# EAGLE design trx (EAGLE 7.7.0)
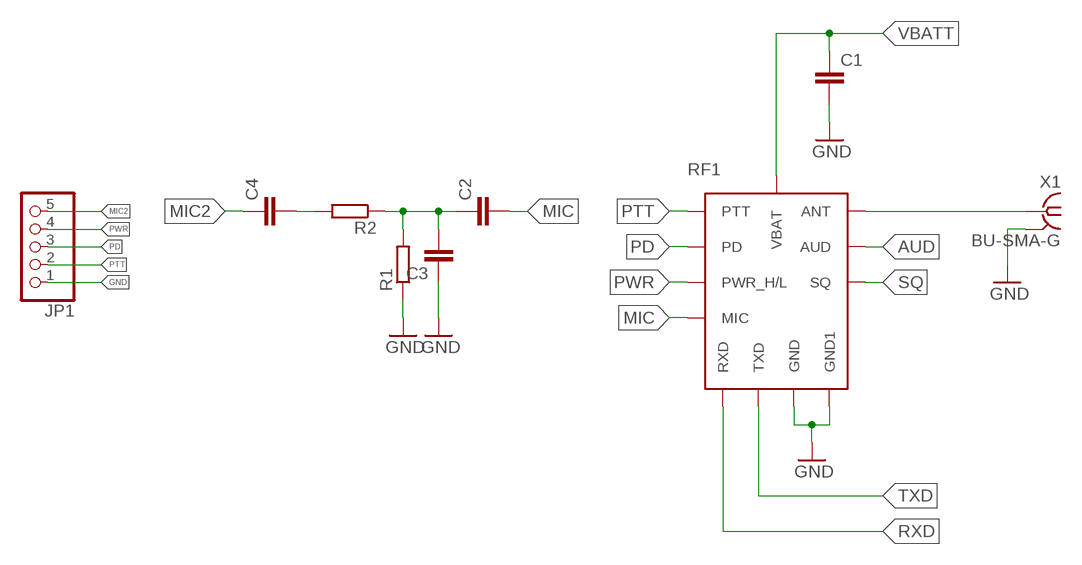
[diagram p0: schematic, sheet 1]

## Parts
C1  C-EUC1206  [C1206]
C2  C-EUC1206  [C1206]
C3  C-EUC1206  [C1206]
C4  C-EUC1206  [C1206]
JP1  PINHD-1X5  [1X05]
R1  R-EU_M1206  [M1206]
R2  R-EU_M1206  [M1206]
RF1  DRA818U  [DRA8XXZ]
X1  BU-SMA-G  [BU-SMA-G]

## Nets
ANT: RF1.P$12(ANT) X1.1
AUD: RF1.P$3(AUD)
GND: C1.2 C3.1 JP1.1 R1.1 RF1.P$9(GND) RF1.P$10(GND1) X1.2 X1.3 X1.4 X1.5
MIC: C2.2 RF1.P$18(MIC)
MIC2: C4.1 JP1.5
N$1: C2.1 C3.2 R1.2 R2.1
N$2: C4.2 R2.2
PD: JP1.3 RF1.P$6(PD)
PTT: JP1.2 RF1.P$5(PTT)
PWR: JP1.4 RF1.P$7(PWR_H/L)
RXD: RF1.P$16(RXD)
SQ: RF1.P$1(SQ)
TXD: RF1.P$17(TXD)
VBATT: C1.1 RF1.P$8(VBAT)

## Library data of the parts
C1-C4 = rcl:C-EU: CAPACITOR, European symbol
JP1 = pinhead:PINHD-1X5: PIN HEADER
R1 R2 = rcl:R-EU_: RESISTOR, European symbol
RF1 = DRA818U:DRA818U: UHF FM module
X1 = con-coax:BU-SMA-G: FEMALE SMA CONNECTOR Radiall distributor RS 193-9117; OC_FARNELL: unknown; OC_NEWARK: unknown

## Board
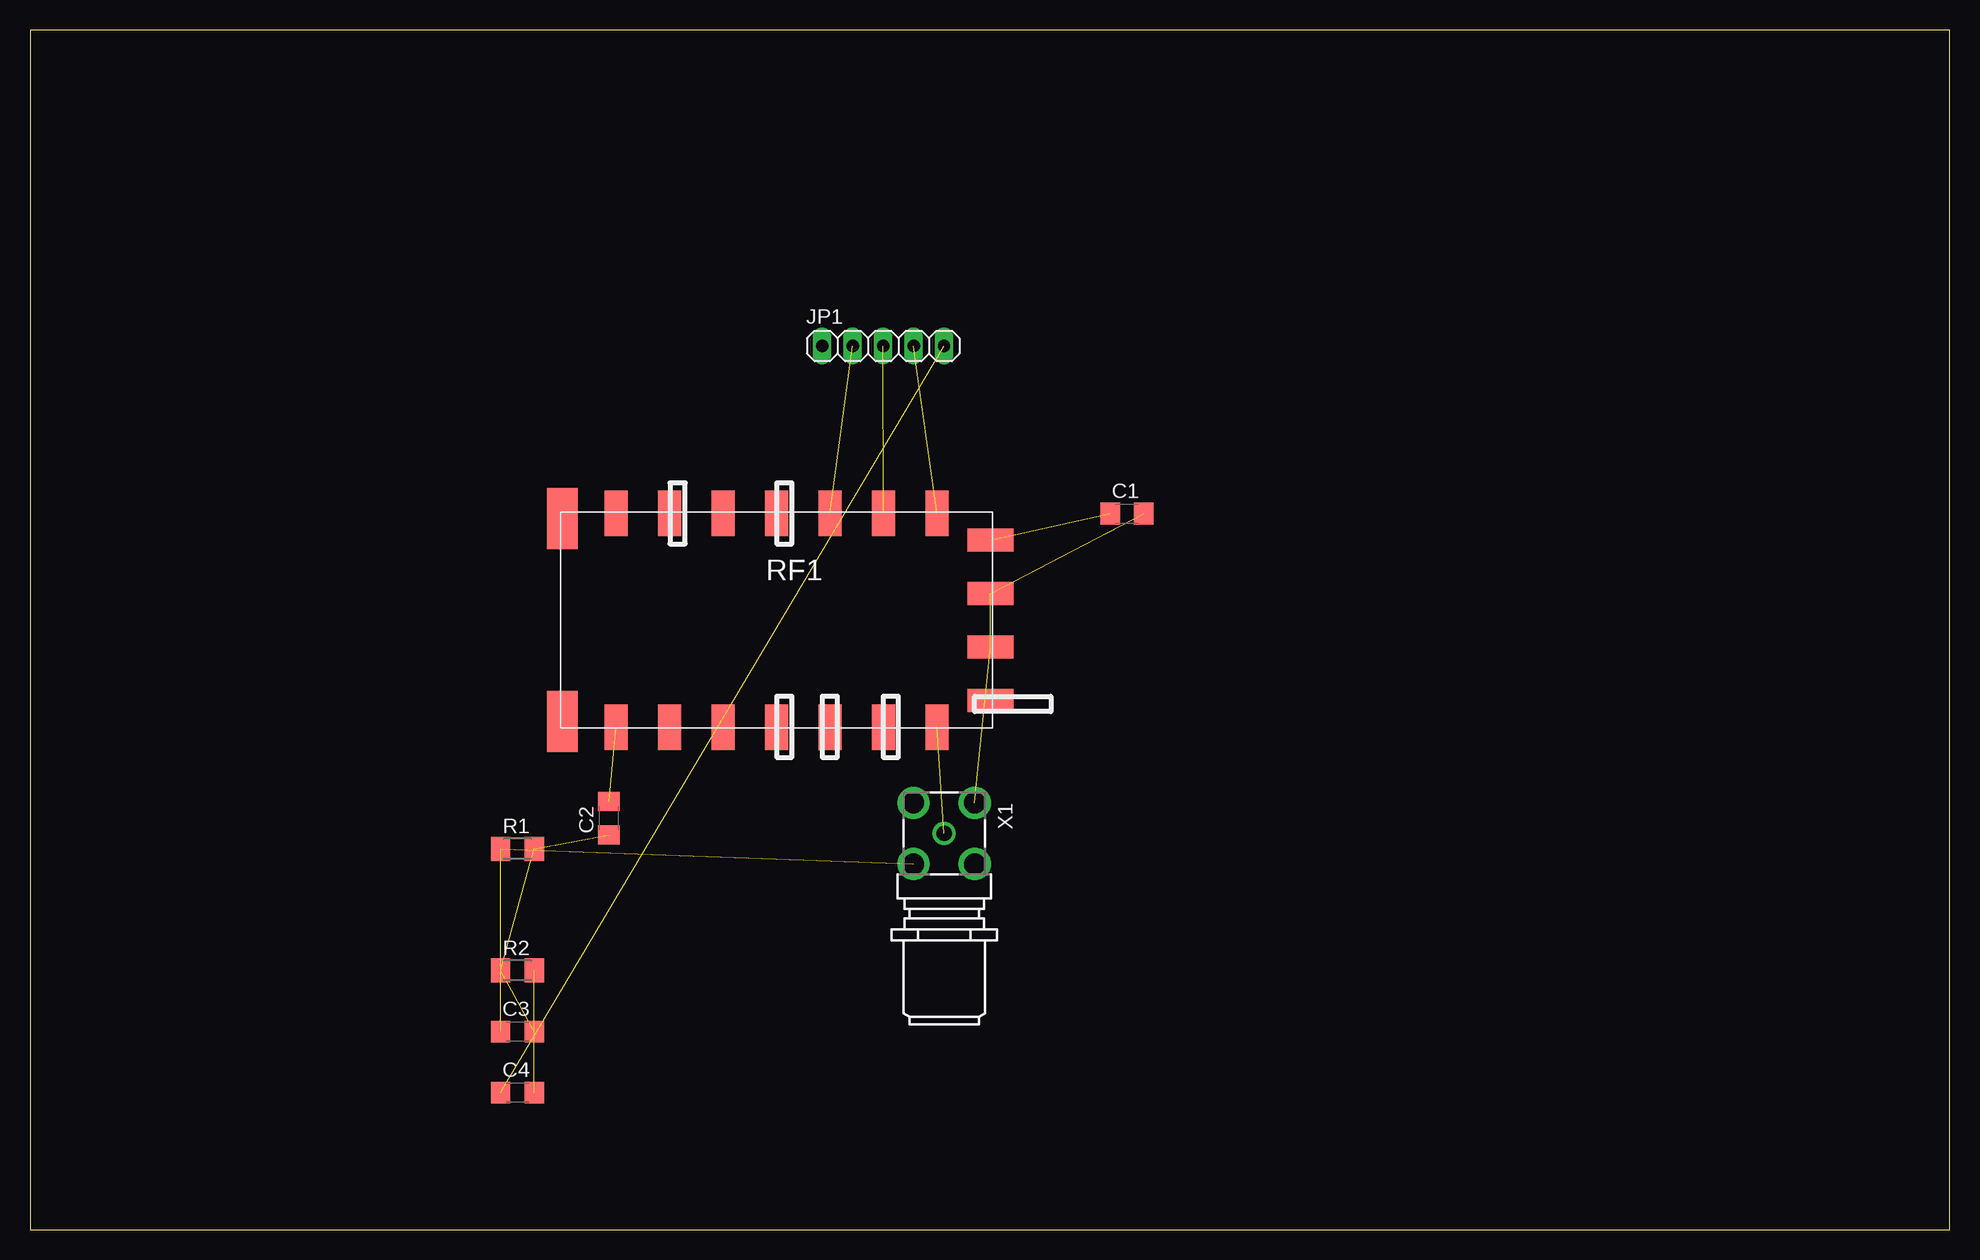
[diagram p1: board, top side]
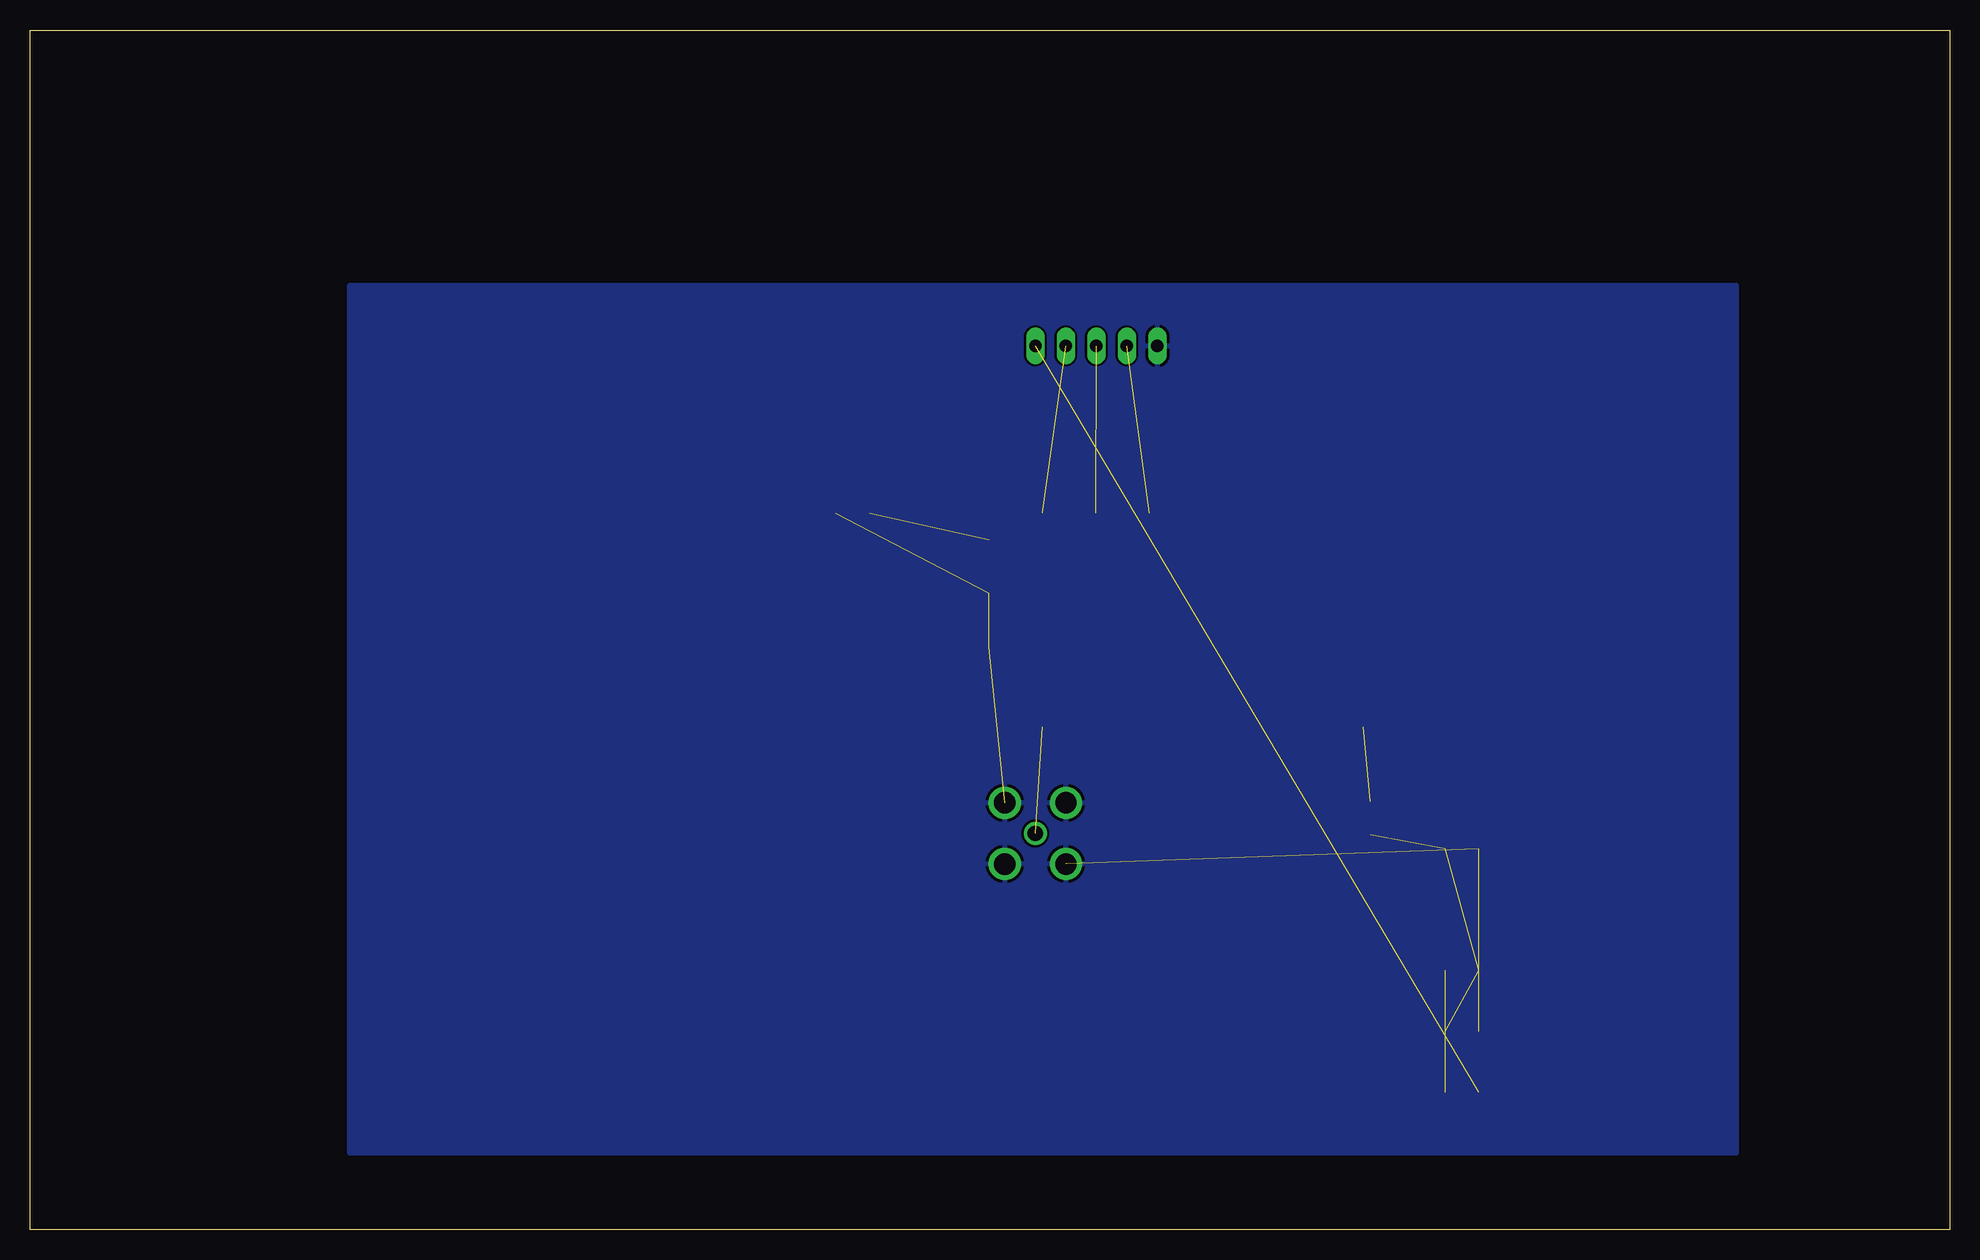
[diagram p2: board, bottom side, seen from below]

Size 160 x 100 mm. Coordinates in mm from the lower left corner, seen from the top.
Outline: 0,0 160,0 160,100 0,100 0,0
Copper layers (1*16): Top 0.035mm / dielectric 1.5mm / Bottom 0.035mm
Design rules "default": minimum track width 10mil, minimum drill 24mil, track to track 8mil, track to pad 8mil, pad to pad 8mil, via to via 8mil, smd to smd 8mil, copper to edge 40mil, drill to drill 8mil, minimum pad ring 10mil, minimum via ring 8mil, stop-mask expansion 4mil, vias tented up to drill 0mil, thermal gap 10mil

### Footprints (pad centres in the part's own frame; a part is rotated, then mirrored left to right if it is on the bottom)
C1206 = smd 1.6 x 1.8: 1 -1.4,0; 2 1.4,0
1X05 = drill 1.016 long: 1 -5.08,0; 2 -2.54,0; 3 0,0; 4 2.54,0; 5 5.08,0
M1206 = smd 1.6 x 2: 1 -1.4,0; 2 1.4,0
DRA8XXZ = smd 1.93 x 3.81: P$1 -13.38,8.92; P$2 -8.92,8.92; P$3 -4.46,8.92; P$4 0,8.92; P$5 4.46,8.92; P$6 8.92,8.92; P$7 13.38,8.92; P$12 13.38,-8.92; P$13 8.92,-8.92; P$14 4.46,-8.92; P$15 0,-8.92; P$16 -4.46,-8.92; P$17 -8.92,-8.92; P$18 -13.38,-8.92 | smd 3.81 x 1.93: P$8 17.84,6.69; P$9 17.84,2.23; P$10 17.84,-2.23; P$11 17.84,-6.69 | smd 2.54 x 5.08: P$19 -17.84,-8.46; P$20 -17.84,8.46
BU-SMA-G = drill 1.27: 1 0,0 | drill 1.778: 2 -2.55,2.55; 3 2.55,2.55; 4 2.55,-2.55; 5 -2.55,-2.55

### Placement (x,y rotation side)
C1  91.44,59.69 0 top
C2  48.26,34.29 90 top
C3  40.64,16.51 0 top
C4  40.64,11.43 0 top
JP1  71.12,73.66 0 top
R1  40.64,31.75 0 top
R2  40.64,21.59 0 top
RF1  62.23,50.8 0 top
X1  76.2,33.02 270 top

### Tracks (layer width: path | path; a pad name or v marks a point on that pad's centre or on a via)
ANT  (1 unrouted)
GND  (5 unrouted)
  pour Bottom: 17.78,78.74 17.78,6.35 133.35,6.35 133.35,78.74
MIC  (1 unrouted)
MIC2  (1 unrouted)
N$1  (3 unrouted)
N$2  (1 unrouted)
PD  (1 unrouted)
PTT  (1 unrouted)
PWR  (1 unrouted)
VBATT  (1 unrouted)